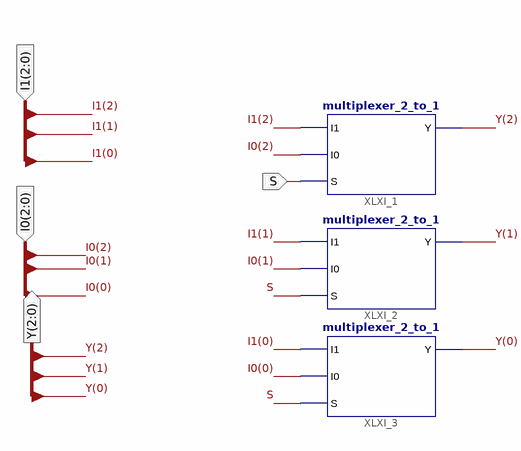
[diagram p0: schematic sheet 1]
// Xilinx ISE schematic multiplexer_2_to_1_3bit.sch (virtex6) as structural Verilog: 3 symbols, 4 ports
module multiplexer_2_to_1_3bit (
  input  S,
  input  [2:0] I1,
  input  [2:0] I0,
  output [2:0] Y
);

  multiplexer_2_to_1 XLXI_1 (.I0(I0[2]), .I1(I1[2]), .S(S), .Y(Y[2]));
  multiplexer_2_to_1 XLXI_2 (.I0(I0[1]), .I1(I1[1]), .S(S), .Y(Y[1]));
  multiplexer_2_to_1 XLXI_3 (.I0(I0[0]), .I1(I1[0]), .S(S), .Y(Y[0]));
endmodule
